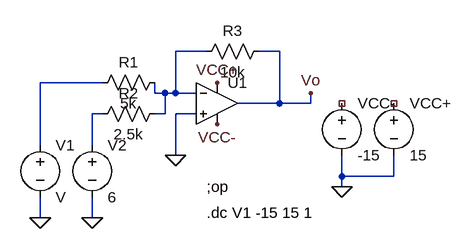
[diagram p0: schematic lab6.asc]
lab6.asc, the LTspice schematic file:
Version 4
SHEET 1 880 680
WIRE 144 96 96 96
WIRE 256 96 224 96
WIRE -16 144 -112 144
WIRE 64 160 64 144
WIRE 80 160 64 160
WIRE 96 160 96 96
WIRE 96 160 80 160
WIRE 128 160 96 160
WIRE 256 176 256 96
WIRE 256 176 192 176
WIRE 304 176 304 160
WIRE 304 176 256 176
WIRE -16 192 -32 192
WIRE 80 192 80 160
WIRE 80 192 64 192
WIRE 128 192 96 192
WIRE -112 240 -112 144
WIRE -32 240 -32 192
WIRE 96 256 96 192
WIRE 352 288 352 256
WIRE 432 288 432 256
WIRE 432 288 352 288
WIRE 352 304 352 288
WIRE -112 352 -112 320
WIRE -32 352 -32 320
FLAG -112 352 0
FLAG -32 352 0
FLAG 96 256 0
FLAG 352 304 0
FLAG 160 208 VCC-
FLAG 160 144 VCC+
FLAG 304 160 Vo
SYMBOL res -32 208 R270
WINDOW 0 32 56 VTop 2
WINDOW 3 0 56 VBottom 2
SYMATTR InstName R2
SYMATTR Value 2.5k
SYMBOL res 128 112 R270
WINDOW 0 32 56 VTop 2
WINDOW 3 0 56 VBottom 2
SYMATTR InstName R3
SYMATTR Value 10k
SYMBOL voltage -112 224 R0
SYMATTR InstName V1
SYMBOL voltage -32 224 R0
WINDOW 123 0 0 Left 2
WINDOW 39 0 0 Left 2
SYMATTR InstName V2
SYMATTR Value 6
SYMBOL res -32 160 R270
WINDOW 0 32 56 VTop 2
WINDOW 3 0 56 VBottom 2
SYMATTR InstName R1
SYMATTR Value 5k
SYMBOL Opamps\\UniversalOpamp2 160 176 R0
SYMATTR InstName U1
SYMBOL voltage 352 160 R0
WINDOW 123 0 0 Left 2
WINDOW 39 0 0 Left 2
SYMATTR InstName VCC-
SYMATTR Value -15
SYMBOL voltage 432 160 R0
WINDOW 123 0 0 Left 2
WINDOW 39 0 0 Left 2
SYMATTR InstName VCC+
SYMATTR Value 15
TEXT 144 304 Left 2 !;op
TEXT 144 344 Left 2 !.dc V1 -15 15 1

The netlist it stands for:
* lab6.asc
R2 N003 N001 2.5k
R3 N001 Vo 10k
V1 N002 0 V
V2 N003 0 6
R1 N002 N001 5k
XU1 0 N001 VCC+ VCC- Vo level.2 Avol=1Meg GBW=10Meg Slew=10Meg ilimit=25m rail=0 Vos=0 phimargin=45 en=0 enk=0 in=0 ink=0 Rin=500Meg  ; pins IN+ IN- V+ V- OUT
VCC- NC_01 0 -15
VCC+ NC_02 0 15
;op
.dc V1 -15 15 1
.lib UniversalOpamps2.sub
.backanno
.end

* Results of the author's LTspice run, read from the files saved beside the schematic
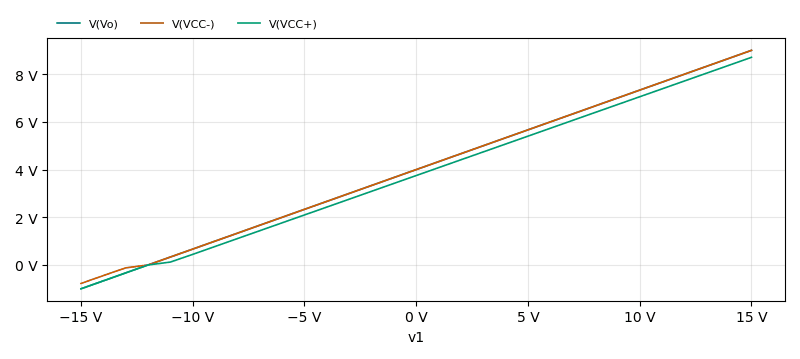
[diagram p1: DC transfer characteristic of lab6.asc, plotted from the saved traces]
* DC transfer characteristic, 1 run:
*   V(Vo): -999.4 mV at v1=-15 V, 8.999 V at v1=15 V, min -999.4 mV, max 8.999 V
*   V(VCC-): -775.7 mV at v1=-15 V, 8.999 V at v1=15 V, min -775.7 mV, max 8.999 V
*   V(VCC+): -999.4 mV at v1=-15 V, 8.707 V at v1=15 V, min -999.4 mV, max 8.707 V